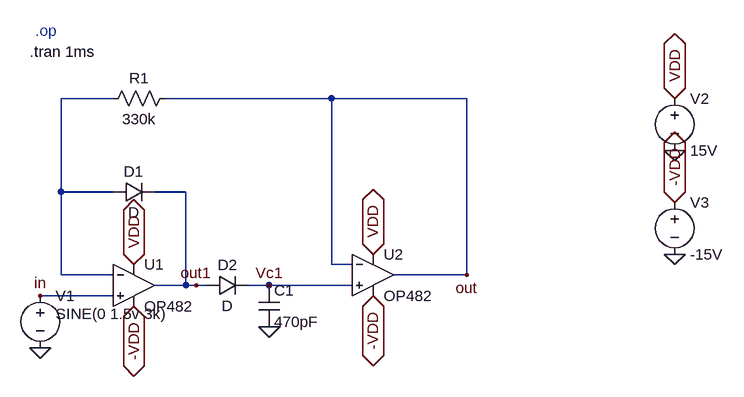
[diagram p0: schematic Draft4.asc]
Draft4.asc, the LTspice schematic file:
Version 4.1
SHEET 1 952 680
WIRE 0 -16 -80 -16
WIRE 336 -16 80 -16
WIRE 544 -16 336 -16
WIRE -80 128 -80 -16
WIRE 0 128 -80 128
WIRE 112 128 64 128
WIRE 336 240 336 -16
WIRE 368 240 336 240
WIRE -80 256 -80 128
WIRE 0 256 -80 256
WIRE 544 256 544 -16
WIRE 544 256 432 256
WIRE 112 272 112 128
WIRE 112 272 64 272
WIRE 128 272 112 272
WIRE 144 272 128 272
WIRE 240 272 208 272
WIRE 368 272 240 272
WIRE 0 288 -112 288
FLAG 240 336 0
FLAG -112 368 0
FLAG 864 64 0
FLAG 864 224 0
FLAG 864 -16 VDD
IOPIN 864 -16 BiDir
FLAG 400 224 VDD
IOPIN 400 224 BiDir
FLAG 32 240 VDD
IOPIN 32 240 BiDir
FLAG 864 144 -VDD
IOPIN 864 144 BiDir
FLAG 400 288 -VDD
IOPIN 400 288 BiDir
FLAG 32 304 -VDD
IOPIN 32 304 BiDir
FLAG 544 256 out
FLAG -112 288 in
FLAG 128 272 out1
FLAG 240 272 Vc1
SYMBOL OpAmps\\OP482 32 208 R0
SYMATTR InstName U1
SYMBOL OpAmps\\OP482 400 192 R0
SYMATTR InstName U2
SYMBOL diode 0 144 R270
WINDOW 0 32 32 VTop 2
WINDOW 3 0 32 VBottom 2
SYMATTR InstName D1
SYMBOL diode 144 288 R270
WINDOW 0 32 32 VTop 2
WINDOW 3 0 32 VBottom 2
SYMATTR InstName D2
SYMBOL res 96 -32 R90
WINDOW 0 0 56 VBottom 2
WINDOW 3 32 56 VTop 2
SYMATTR InstName R1
SYMATTR Value 330k
SYMBOL cap 224 272 R0
SYMATTR InstName C1
SYMATTR Value 470pF
SYMBOL voltage -112 272 R0
WINDOW 123 24 124 Left 2
WINDOW 39 0 0 Left 0
WINDOW 3 24 44 Left 2
SYMATTR Value SINE(0 1.5v 3k)
SYMATTR InstName V1
SYMBOL voltage 864 -32 R0
SYMATTR InstName V2
SYMATTR Value 15V
SYMBOL voltage 864 128 R0
SYMATTR InstName V3
SYMATTR Value -15V
TEXT -128 -88 Left 2 !.tran 1ms
TEXT -120 -120 Left 2 ;.op

The netlist it stands for:
* Draft4.asc
X§U1 in N001 VDD -VDD out1 OP482  ; pins In+ In- V+ V- OUT
X§U2 Vc1 out VDD -VDD out OP482  ; pins In+ In- V+ V- OUT
D1 N001 out1 D
D2 out1 Vc1 D
R1 out N001 330k
C1 Vc1 0 470pF
V1 in 0 SINE(0 1.5v 3k)
V2 VDD 0 15V
V3 -VDD 0 -15V
.model D D
.lib standard.dio
.tran 1ms
* .op
.backanno
.end